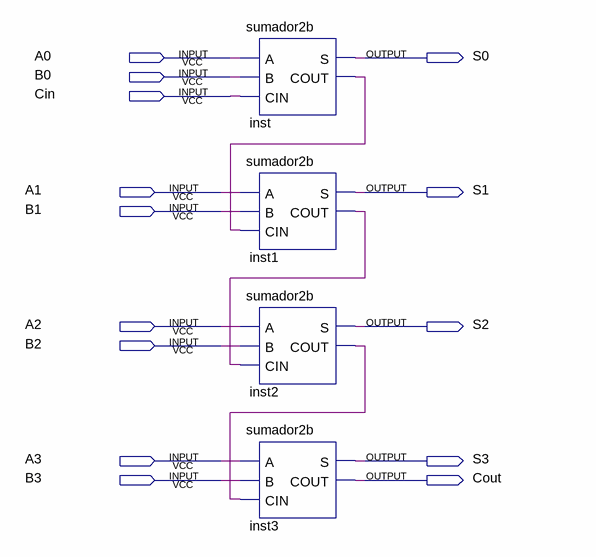
[diagram p0: schematic sheet]
// Quartus schematic Sum4b.bdf as structural Verilog: 4 symbols, 14 pins
module Sum4b (
  input  A0,
  input  B0,
  input  Cin,
  input  A1,
  input  B1,
  input  A2,
  input  B2,
  input  A3,
  input  B3,
  output S0,
  output S1,
  output S2,
  output S3,
  output Cout
);

  wire inst1_cout, inst2_cout, inst_cout;

  sumador2b inst (.A(A0), .B(B0), .CIN(Cin), .S(S0), .COUT(inst_cout));
  sumador2b inst1 (.A(A1), .B(B1), .CIN(inst_cout), .S(S1), .COUT(inst1_cout));
  sumador2b inst2 (.A(A2), .B(B2), .CIN(inst1_cout), .S(S2), .COUT(inst2_cout));
  sumador2b inst3 (.A(A3), .B(B3), .CIN(inst2_cout), .S(S3), .COUT(Cout));
endmodule
